# Altium schematic sheet TK90X.SchDoc
size A3
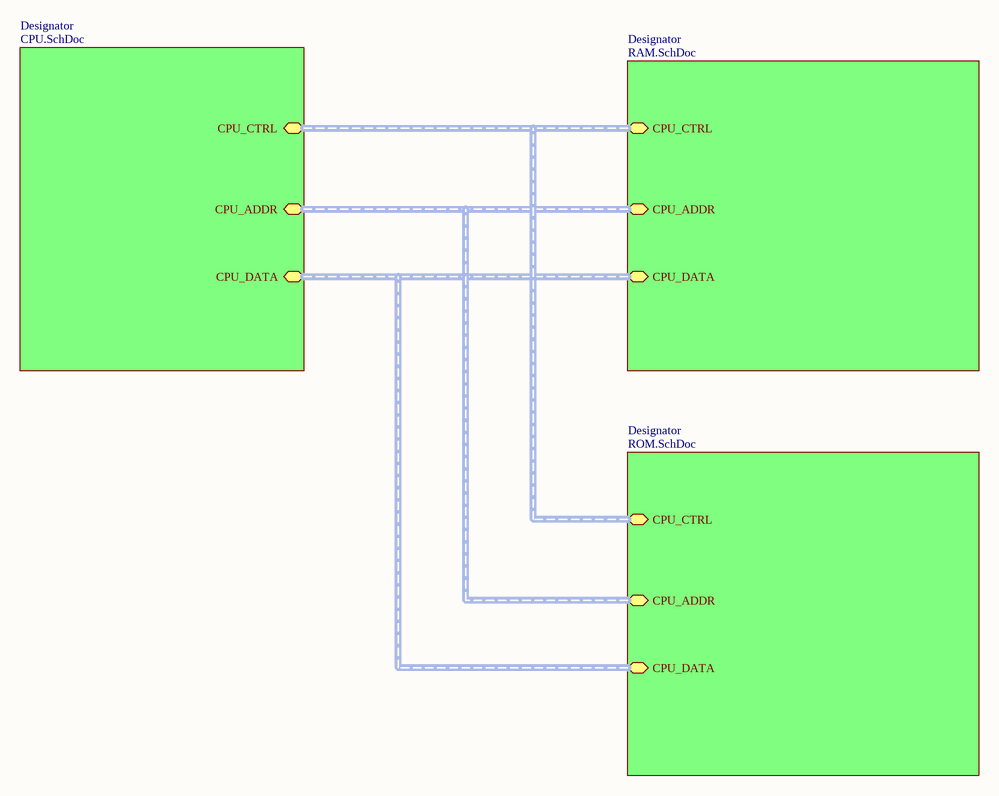
[diagram p0: TK90X.SchDoc]

## Sub-sheets
Designator = CPU.SchDoc: CPU_CTRL (harness CPU_CTRL), CPU_ADDR (harness CPU_ADDR), CPU_DATA (harness CPU_DATA)
Designator = RAM.SchDoc: CPU_CTRL (harness CPU_CTRL), CPU_ADDR (harness CPU_ADDR), CPU_DATA (harness CPU_DATA)
Designator = ROM.SchDoc: CPU_CTRL (harness CPU_CTRL), CPU_ADDR (harness CPU_ADDR), CPU_DATA (harness CPU_DATA)